# Altium schematic sheet ADC_Block.SchDoc
size A4; SheetNumber: 11; SheetTotal: 13
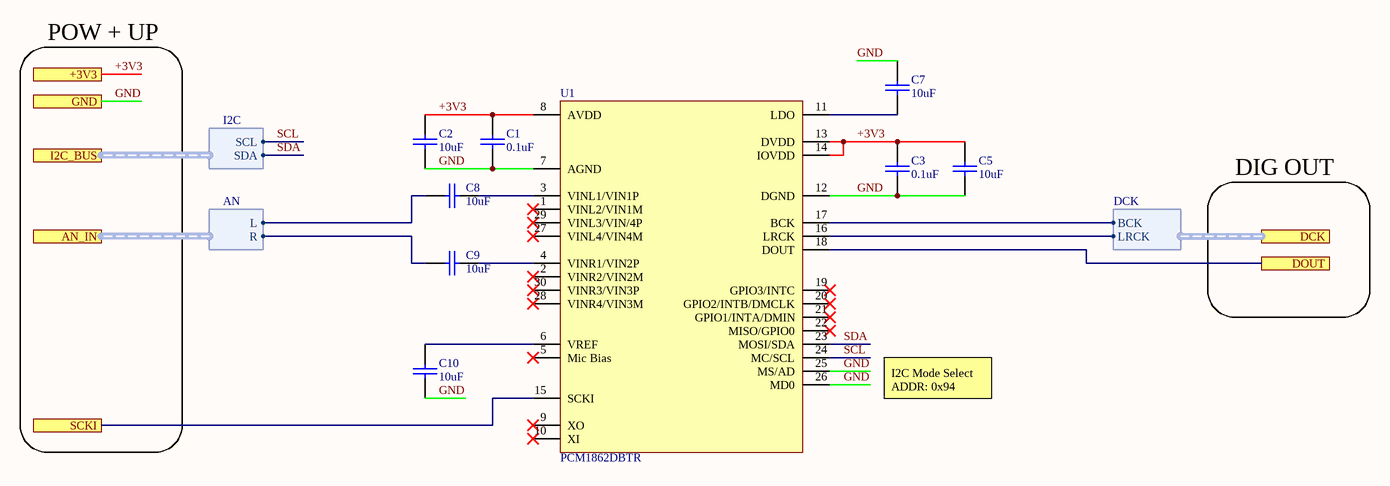
[diagram p0: ADC_Block.SchDoc]

## Parts
C1  0.1uF  [0402-CAP-TDK]
C2  10uF  [0603-CAP-TDK]
C3  0.1uF  [0402-CAP-TDK]
C5  10uF  [0603-CAP-TDK]
C7  10uF  [0603-CAP-TDK]
C8  10uF  [0603-CAP-TDK]
C9  10uF  [0603-CAP-TDK]
C10  10uF  [0603-CAP-TDK]
U1  PCM1862DBTR  [TI-TSSOP-30-DBT0030A]

## Ports
+3V3 (see ADC_Interface[2B], ADC_Interface[1B], CTRL_Connectors[1A], DAC_Block[1B], DSP_Block[1A], MCU_Block[1A], PLL_Block[1A], POW_Block[4B]), AN_IN (harness AN, see ADC_Interface[2B]), DCK (harness DCK, see ADC_Interface[3B], ADC_Interface[4B]), DOUT (see ADC_Interface[3B]), GND (see ADC_Interface[2B], ADC_Interface[1B], CTRL_Connectors[1A], DAC_Block[1B], DSP_Block[1B], IN_Connectors[3A], LPF_Block[1B], LPF_Interface[1B], MCU_Block[1B], OUT_Connectors[3B], PLL_Block[1A], POW_Block[1B]), I2C_BUS (harness I2C, see ADC_Interface[2B], DAC_Block[1B]), SCKI (see ADC_Interface[2B])

## Harnesses
I2C: SCL, SDA
AN: L, R
DCK: BCK, LRCK

## Nets
+3V3: C1.2 C2.2 C3.2 C5.2 U1.8(AVDD) U1.13(DVDD) U1.14(IOVDD) ; port +3V3
DOUT: U1.18(DOUT) ; port DOUT
GND: C1.1 C2.1 C3.1 C5.1 C7.2 C10.1 U1.7(AGND) U1.12(DGND) U1.25(MS/AD) U1.26(MD0) ; port GND
SCKI: U1.15(SCKI) ; port SCKI
SCL: U1.24(MC/SCL) ; port I2C_BUS.SCL
SDA: U1.23(MOSI/SDA) ; port I2C_BUS.SDA
NetC7_1: C7.1 U1.11(LDO)
NetC8_1: C8.1 U1.3(VINL1/VIN1P)
NetC8_2: C8.2 ; port AN_IN.L
NetC9_1: C9.1 U1.4(VINR1/VIN2P)
NetC9_2: C9.2 ; port AN_IN.R
NetC10_2: C10.2 U1.6(VREF)
NetU1_16: U1.16(LRCK) ; port DCK.LRCK
NetU1_17: U1.17(BCK) ; port DCK.BCK

Not connected (* = marked no-connect by the designer): U1 1(VINL2/VIN1M)* 2(VINR2/VIN2M)* 5(Mic_Bias)* 9(XO)* 10(XI)* 19(GPIO3/INTC)* 20(GPIO2/INTB/DMCLK)* 21(GPIO1/INTA/DMIN)* 22(MISO/GPIO0)* 27(VINL4/VIN4M)* 28(VINR4/VIN3M)* 29(VINL3/VIN/4P)* 30(VINR3/VIN3P)*

## Notes on the sheet
- POW + UP
- DIG OUT
- I2C Mode Select
  ADDR: 0x94

## Library data of the parts
C1-C3 C5 C7-C10 = CAP-SMD
  C1 C3: JLCPart: C307331
  C2 C5 C7-C10: JLCPart: C96446
U1 = PCM1862DBTR: JLCPart: C544647